# EAGLE design quadcopter (EAGLE 8.1.1)
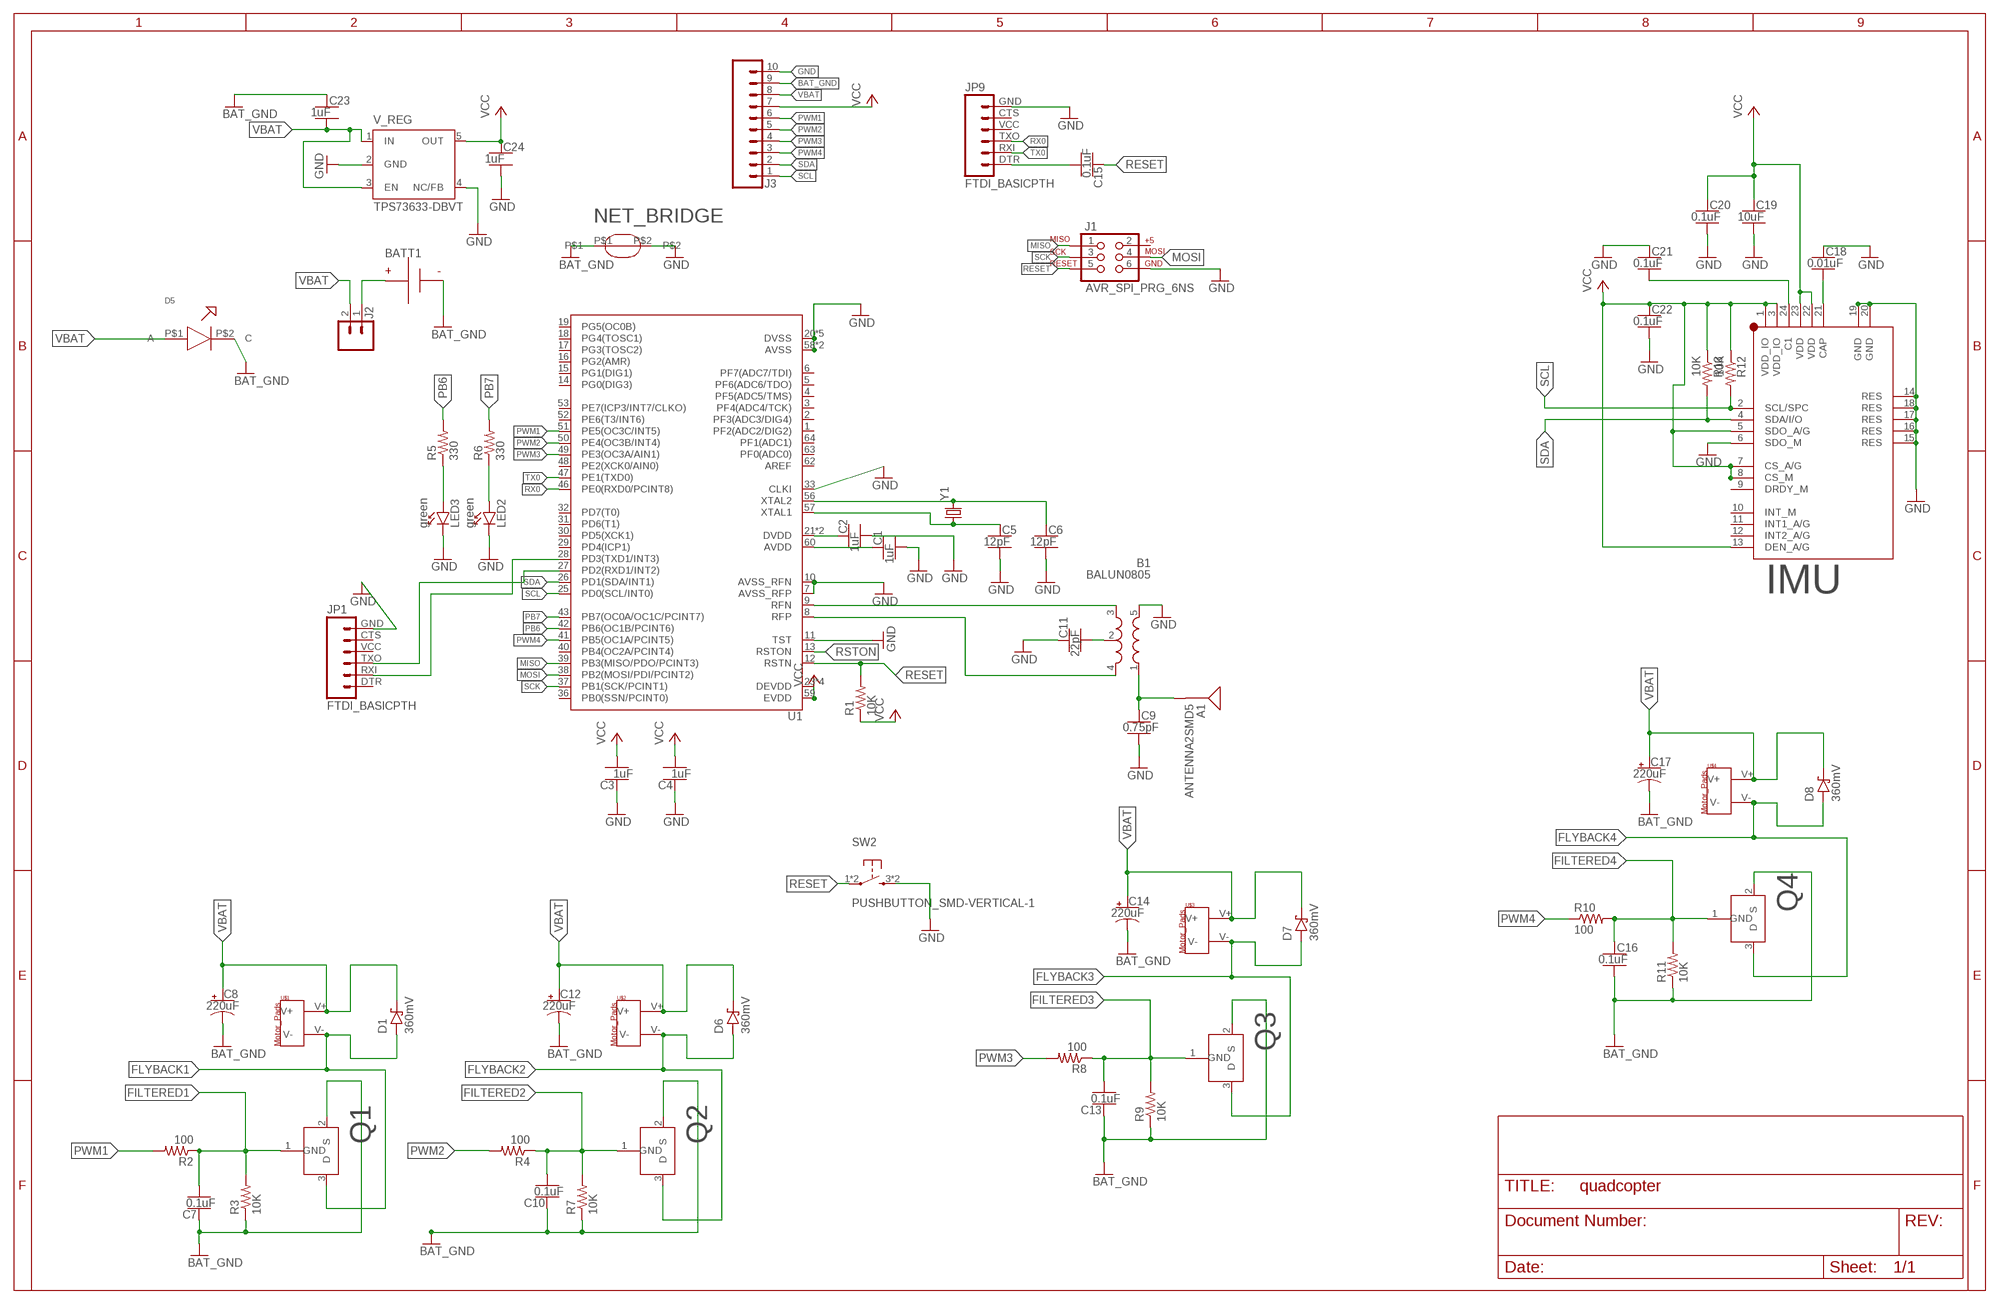
[diagram p0: schematic, sheet 1]

## Parts
A1  ANTENNA2SMD5  [ANTENNA-CHIP5]
B1  BALUN0805  [BALUN]
BATT1  BATTERY-HUBSAN-W/HOLDER  [BATTERY-W/HOLDER-380MAH-HUBSAN]
C1  1uF  CAPACITOR-NP_SMD-2012-0805_CERAMIC-1UF  [CAPC2012X140_HS]
C2  1uF  CAPACITOR-NP_SMD-2012-0805_CERAMIC-1UF  [CAPC2012X140_HS]
C3  1uF  CAPACITOR-NP_SMD-2012-0805_CERAMIC-1UF  [CAPC2012X140_HS]
C4  1uF  CAPACITOR-NP_SMD-2012-0805_CERAMIC-1UF  [CAPC2012X140_HS]
C5  12pF  CAPACITOR-NP_SMD-2012-0805_CERAMIC-12PF  [CAPC2012X140_HS]
C6  12pF  CAPACITOR-NP_SMD-2012-0805_CERAMIC-12PF  [CAPC2012X140_HS]
C7  0.1uF  CAPACITOR-NP_SMD-2012-0805_CERAMIC-0.1UF  [CAPC2012X140_HS]
C8  220uF  CAPACITOR-POL_SMD-7043-D_TANTALUM-220UF  [CAPMP7343X310_HS]
C9  0.75pF  CAPACITOR-NP_SMD-2012-0805_CERAMIC-0.75PF  [CAPC2012X140_HS]
C10  0.1uF  CAPACITOR-NP_SMD-2012-0805_CERAMIC-0.1UF  [CAPC2012X140_HS]
C11  22pF  CAPACITOR-NP_SMD-2012-0805_CERAMIC-22PF  [CAPC2012X140_HS]
C12  220uF  CAPACITOR-POL_SMD-7043-D_TANTALUM-220UF  [CAPMP7343X310_HS]
C13  0.1uF  CAPACITOR-NP_SMD-2012-0805_CERAMIC-0.1UF  [CAPC2012X140_HS]
C14  220uF  CAPACITOR-POL_SMD-7043-D_TANTALUM-220UF  [CAPMP7343X310_HS]
C15  0.1uF  CAPACITOR-NP_SMD-2012-0805_CERAMIC-0.1UF  [CAPC2012X140_HS]
C16  0.1uF  CAPACITOR-NP_SMD-2012-0805_CERAMIC-0.1UF  [CAPC2012X140_HS]
C17  220uF  CAPACITOR-POL_SMD-7043-D_TANTALUM-220UF  [CAPMP7343X310_HS]
C18  0.01uF  CAPACITOR-NP_SMD-2012-0805_CERAMIC-0.01UF  [CAPC2012X140_HS]
C19  10uF  CAPACITOR-NP_SMD-2012-0805_CERAMIC-10UF  [CAPC2012X140_HS]
C20  0.1uF  CAPACITOR-NP_SMD-2012-0805_CERAMIC-0.1UF  [CAPC2012X140_HS]
C21  0.1uF  CAPACITOR-NP_SMD-2012-0805_CERAMIC-0.1UF  [CAPC2012X140_HS]
C22  0.1uF  CAPACITOR-NP_SMD-2012-0805_CERAMIC-0.1UF  [CAPC2012X140_HS]
C23  1uF  CAPACITOR-NP_SMD-2012-0805_CERAMIC-1UF  [CAPC2012X140_HS]
C24  1uF  CAPACITOR-NP_SMD-2012-0805_CERAMIC-1UF  [CAPC2012X140_HS]
D1  360mV  DIODE-SCHOTTKY_SMD-SOD123-360MV  [SOD3716X135_HS]
D5  BLUE_LED  [BLUE_LED]
D6  360mV  DIODE-SCHOTTKY_SMD-SOD123-360MV  [SOD3716X135_HS]
D7  360mV  DIODE-SCHOTTKY_SMD-SOD123-360MV  [SOD3716X135_HS]
D8  360mV  DIODE-SCHOTTKY_SMD-SOD123-360MV  [SOD3716X135_HS]
IMU  9-AXIS_IMU  [9-AXIS_IMU]
J1  AVR_SPI_PRG_6NS  [2X3-NS]
J2  MALE_HEADER_2POS-2X1-0.1IN  [MALE_HEADER_2X1_0.1IN]
J3  SIP-10_TH-254X10  [HDRV10W63P254_10X1_2540X254H838_HS]
JP1  FTDI_BASICPTH  [FTDI_BASIC]
JP9  FTDI_BASICPTH  [FTDI_BASIC]
LED2  green  DIODE-LED_SMD-2012-0805-GREEN  [LEDSC125X200X120-2_HS]
LED3  green  DIODE-LED_SMD-2012-0805-GREEN  [LEDSC125X200X120-2_HS]
NET_BRIDGE  NET_BRIDGE  [NET_BRIDGE]
Q1  N-CHANNEL_MOSFET  [N-CHANNEL_MOSFET]
Q2  N-CHANNEL_MOSFET  [N-CHANNEL_MOSFET]
Q3  N-CHANNEL_MOSFET  [N-CHANNEL_MOSFET]
Q4  N-CHANNEL_MOSFET  [N-CHANNEL_MOSFET]
R1  10K  RESISTOR_SMD-2012-0805-10K  [RESC2012X60_HS]
R2  100  RESISTOR_SMD-2012-0805-100  [RESC2012X60_HS]
R3  10K  RESISTOR_SMD-2012-0805-10K  [RESC2012X60_HS]
R4  100  RESISTOR_SMD-2012-0805-100  [RESC2012X60_HS]
R5  330  RESISTOR_SMD-2012-0805-330  [RESC2012X60_HS]
R6  330  RESISTOR_SMD-2012-0805-330  [RESC2012X60_HS]
R7  10K  RESISTOR_SMD-2012-0805-10K  [RESC2012X60_HS]
R8  100  RESISTOR_SMD-2012-0805-100  [RESC2012X60_HS]
R9  10K  RESISTOR_SMD-2012-0805-10K  [RESC2012X60_HS]
R10  100  RESISTOR_SMD-2012-0805-100  [RESC2012X60_HS]
R11  10K  RESISTOR_SMD-2012-0805-10K  [RESC2012X60_HS]
R12  10K  RESISTOR_SMD-2012-0805-10K  [RESC2012X60_HS]
R13  10K  RESISTOR_SMD-2012-0805-10K  [RESC2012X60_HS]
SW2  PUSHBUTTON_SMD-VERTICAL-1  [TE_FSM8JSMA_HS]
U1  ATMEGA128RFA1  [QFN-64]
U$1  MOTOR_PADS  [MOTOR_PADS]
U$2  MOTOR_PADS  [MOTOR_PADS]
U$3  MOTOR_PADS  [MOTOR_PADS]
U$4  MOTOR_PADS  [MOTOR_PADS]
V_REG  TPS73633-DBVT  [SOT23-DBV]
Y1  CRYSTAL5X3  [CRYSTAL-SMD-5X3]

## Nets
BAT_GND [HIGHCURRENT]: BATT1.-(N) C7.1 C8.2(-) C10.1 C12.2(-) C13.1 C14.2(-) C16.2 C17.2(-) C23.1 D5.P$2(C) J3.9 NET_BRIDGE.P$1 Q1.2(S) Q2.2(S) Q3.2(S) Q4.2(S) R3.1 R7.1 R9.1 R11.1
FILTERED1 [HIGHCURRENT]: C7.2 Q1.1(GND) R2.1 R3.2
FILTERED2 [HIGHCURRENT]: C10.2 Q2.1(GND) R4.1 R7.2
FILTERED3 [HIGHCURRENT]: C13.2 Q3.1(GND) R8.1 R9.2
FILTERED4 [HIGHCURRENT]: C16.1 Q4.1(GND) R10.2 R11.2
FLYBACK1 [HIGHCURRENT]: D1.A Q1.3(D) U$1.V-
FLYBACK2 [HIGHCURRENT]: D6.A Q2.3(D) U$2.V-
FLYBACK3 [HIGHCURRENT]: D7.A Q3.3(D) U$3.V-
FLYBACK4 [HIGHCURRENT]: D8.A Q4.3(D) U$4.V-
GND: B1.5(GND) C1.2 C2.2 C3.1 C4.1 C5.2 C6.2 C9.2 C11.1 C18.1 C19.2 C20.2 C21.1 C22.2 C24.2 IMU.6(SDO_M) IMU.14(RES) IMU.15(RES) IMU.16(RES) IMU.17(RES) IMU.18(RES) IMU.19(GND) IMU.20(GND) J1.6 J3.10 JP1.GND JP9.GND LED2.C LED3.C NET_BRIDGE.P$2 SW2.3 SW2.4 U1.7(AVSS_RFP) U1.10(AVSS_RFN) U1.11(TST) U1.20(DVSS) U1.24(DVSS) U1.33(CLKI) U1.35(DVSS) U1.45(DVSS) U1.55(DVSS) U1.58(AVSS) U1.61(AVSS) V_REG.2(GND) V_REG.4(NC/FB)
MISO: J1.1 U1.39(PB3(MISO/PDO/PCINT3))
MOSI: J1.4 U1.38(PB2(MOSI/PDI/PCINT2))
N$1: C5.1 U1.57(XTAL1) Y1.1
N$2: C2.1 U1.21(DVDD) U1.22(DVDD)
N$3: B1.3(OUT2) U1.9(RFN)
N$4: C1.1 U1.60(AVDD)
N$5: B1.4(OUT1) U1.8(RFP)
N$6: C6.1 U1.56(XTAL2) Y1.3
N$7: B1.2(GND) C11.2
N$8 [RFSIG]: A1.FEED(SIGNAL) B1.1(IN) C9.1
N$9: JP1.TXO U1.27(PD2(RXD1/INT2))
N$10: LED3.A R5.1
N$11: LED2.A R6.1
N$12: JP1.RXI U1.28(PD3(TXD1/INT3))
N$13: C18.2 IMU.21(CAP)
N$14: C15.2 JP9.DTR
N$15: C21.2 IMU.24(C1)
N$18 [HIGHCURRENT]: BATT1.+(P) J2.1
PB6: R5.2 U1.42(PB6(OC1B/PCINT6))
PB7: R6.2 U1.43(PB7(OC0A/OC1C/PCINT7))
PWM1: J3.6 R2.2 U1.51(PE5(OC3C/INT5))
PWM2: J3.5 R4.2 U1.50(PE4(OC3B/INT4))
PWM3: J3.4 R8.2 U1.49(PE3(OC3A/AIN1))
PWM4: J3.3 R10.1 U1.41(PB5(OC1A/PCINT5))
RESET: C15.1 J1.5 R1.2 SW2.1 SW2.2 U1.12(RSTN)
RSTON: U1.13(RSTON)
RX0: JP9.TXO U1.46(PE0(RXD0/PCINT8))
SCK: J1.3 U1.37(PB1(SCK/PCINT1))
SCL: IMU.2(SCL/SPC) J3.1 R12.2 U1.25(PD0(SCL/INT0))
SDA: IMU.4(SDA/I/O) J3.2 R13.2 U1.26(PD1(SDA/INT1))
TX0: JP9.RXI U1.47(PE1(TXD0))
VBAT [HIGHCURRENT]: C8.1(+) C12.1(+) C14.1(+) C17.1(+) C23.2 D1.C D5.P$1(A) D6.C D7.C D8.C J2.2 J3.8 U$1.V+ U$2.V+ U$3.V+ U$4.V+ V_REG.1(IN) V_REG.3(EN)
VCC: C3.2 C4.2 C19.1 C20.1 C22.1 C24.1 IMU.1(VDD_IO) IMU.3(VDD_IO) IMU.5(SDO_A/G) IMU.7(CS_A/G) IMU.8(CS_M) IMU.13(DEN_A/G) IMU.22(VDD) IMU.23(VDD) J3.7 R1.1 R12.1 R13.1 U1.23(DEVDD) U1.34(DEVDD) U1.44(DEVDD) U1.54(DEVDD) U1.59(EVDD) V_REG.5(OUT)
Unconnected: IMU.9(DRDY_M) IMU.10(INT_M) IMU.11(INT1_A/G) IMU.12(INT2_A/G) J1.2 JP1.CTS JP1.DTR JP1.VCC JP9.CTS JP9.VCC U1.1(PF2(ADC2/DIG2)) U1.2(PF3(ADC3/DIG4)) U1.3(PF4(ADC4/TCK)) U1.4(PF5(ADC5/TMS)) U1.5(PF6(ADC6/TDO)) U1.6(PF7(ADC7/TDI)) U1.14(PG0(DIG3)) U1.15(PG1(DIG1)) U1.16(PG2(AMR)) U1.17(PG3(TOSC2)) U1.18(PG4(TOSC1)) U1.19(PG5(OC0B)) U1.29(PD4(ICP1)) U1.30(PD5(XCK1)) U1.31(PD6(T1)) U1.32(PD7(T0)) U1.36(PB0(SSN/PCINT0)) U1.40(PB4(OC2A/PCINT4)) U1.48(PE2(XCK0/AIN0)) U1.52(PE6(T3/INT6)) U1.53(PE7(ICP3/INT7/CLKO)) U1.62(AREF) U1.63(PF0(ADC0)) U1.64(PF1(ADC1))

## Library data of the parts
A1 = quadparts_prebuilt:ANTENNA2: Chip antenna Single endded antenna. Common with smaller chip antennas. CHIP4 package is the GPS Chip Antenna SKU: GPS-08418. CHIP5 package is 2.4GHz chip antenna SKU: WRL-00144.; DATASHEET: http://www.linxtechnologies.com/resources/data-guides/ant-xxx-chp-x.pdf; DIST: Digikey; DISTPN: ANT-2.45-CHPCT-ND; MFR: Linx Technologies Inc.; MPN: ANT-2.45-CHP-T; PRICE: 3.16
B1 = quadparts_prebuilt:BALUN: 0805 footprint balun- Ember 351/357; DATASHEET: http://katalog.we-online.de/pbs/datasheet/748421245.pdf; DIST: Digikey; DISTPN: 732-2230-6-ND; MFR: Wurth Electronics Inc; MPN: 748421245; PRICE: 2.63
BATT1 = quadparts_prebuilt:BATTERY; CREATOR: Swanson; DIST: AMAZON; DISTPN: http://www.amazon.com/dp/B00RROB6Q4?smid=AMNTPWSAB5H0S; MFR: HUBSAN; MPN: X4-H107C-8-in-1
C1-C4 C23 C24 = quadparts_prebuilt:CAPACITOR-NP_: Nonpolarized capacitor; DIST: Digikey; DISTPN: 490-4736-1-ND; MFR: Murata Electronics North America; MPN: GRM21BR71H105KA12L
C5 C6 = quadparts_prebuilt:CAPACITOR-NP_: Nonpolarized capacitor; DIST: Digikey; DISTPN: 490-5531-1-ND; MFR: Murata Electronics North America; MPN: GRM21A5C2E120JW01D
C7 C10 C13 C15 C16 C20-C22 = quadparts_prebuilt:CAPACITOR-NP_: Nonpolarized capacitor; DIST: Digikey; DISTPN: 490-1666-1-ND; MFR: Murata Electronics North America; MPN: GRM21BR71H104KA01L
C8 C12 C14 C17 = quadparts_prebuilt:CAPACITOR-POL_: Polarized capacitor; DIST: Digikey; DISTPN: 478-8912-1-ND; MFR: AVX Corporation; MPN: TAJD227K006RNJ
C9 = quadparts_prebuilt:CAPACITOR-NP_: Nonpolarized capacitor; DIST: Digikey; DISTPN: 490-3585-1-ND; MFR: Murata Electronics North America; MPN: GQM2195C2AR75CB01D
C11 = quadparts_prebuilt:CAPACITOR-NP_: Nonpolarized capacitor; DIST: Digikey; DISTPN: 490-5534-1-ND; MFR: Murata Electronics North America; MPN: GRM21A5C2E220JW01D
C18 = quadparts_prebuilt:CAPACITOR-NP_: Nonpolarized capacitor; DIST: Digikey; DISTPN: 490-8295-1-ND; MFR: Murata Electronics North America; MPN: GRM2195C1H103FA01D
C19 = quadparts_prebuilt:CAPACITOR-NP_: Nonpolarized capacitor; DIST: Digikey; DISTPN: 490-5523-1-ND; MFR: Murata Electronics North America; MPN: GRM21BR61E106KA73L
D1 D6-D8 = quadparts_prebuilt:DIODE-SCHOTTKY_: Schottky diode; DIST: Digikey; DISTPN: CRS08QMCT-ND; MFR: Toshiba Semiconductor and Storage; MPN: CRS08(TE85L,Q,M)
D5 = LED:BLUE_LED; CREATOR: John Wu; DATASHEET: https://media.digikey.com/pdf/Data%20Sheets/Everlight%20PDFs/QTLP600C.pdf; DIST: Digikey; DISTPN: 1080-1401-1-ND; MFR: Everlight Electronics Co Ltd; MPN: QTLP600CBTR; REVIEWER: Josh Crook
IMU = quadparts-nick:9-AXIS_IMU: LSM9DS1TR 9-Axis IMU; CREATOR: Nicholas Deagon; DIST: Digikey; DISTPN: 497-14946-1-ND; MFR: STMicroelectronics; MPN: LSM9DS1TR; REVIEWER: Joshua Crook
J1 = quadparts_prebuilt:AVR_SPI_PRG_6: AVR ISP 6 Pin This is the reduced ISP connector for AVR programming. Common on Arduino. This footprint will take up less PCB space and can be used with a 10-pin to 6-pin adapter such as SKU: BOB-08508; DATASHEET: http://portal.fciconnect.com/Comergent//fci/drawing/67996.pdf; DIST: Digikey; DISTPN: 609-3234-ND; MFR: Amphenol FCI; MPN: 67997-206HLF; PRICE: 0.31
J2 = quadparts-nick:MALE_HEADER_2POS: 2 pin single inline pin header, socket, or connector; CREATOR: SWANSON; DIST: Digikey; DISTPN: 3M9447-ND; MFR: 3M; MPN: 961102-6404-AR
J3 = quadparts_prebuilt:SIP-10_: 10 pin single inline pin header, socket, or connector; DATASHEET: http://portal.fciconnect.com/Comergent//fci/drawing/68000.pdf; DIST: Digikey; DISTPN: 609-3250-ND; MFR: Amphenol FCI; MPN: 68000-110HLF; PRICE: 0.55
JP1 JP9 = quadparts_prebuilt:FTDI_BASIC: FTDI Basic header with labels; DATASHEET: http://portal.fciconnect.com/Comergent//fci/drawing/68015.pdf; DIST: Digikey; DISTPN: 609-3327-ND; MFR: Amphenol FCI; MPN: 68016-406HLF; PRICE: 0.33
LED2 LED3 = quadparts_prebuilt:DIODE-LED_: Light emitting diode; DIST: Digikey; DISTPN: 160-1179-1-ND; MFR: Lite-On Inc; MPN: LTST-C170GKT
NET_BRIDGE = quadparts-nick:NET_BRIDGE; CREATOR: Nicholas Deagon; REVIEWER: Joshua Crook
Q1-Q4 = quadparts-nick:N-CHANNEL_MOSFET: N-Channel MOSFET; CREATOR: Nicholas Deagon; DIST: Digikey; DISTPN: SI2302CDS-T1-E3CT-ND; MFR: Vishay Siliconix; MPN: SI2302CDS-T1-E3; REVIEWER: Joshua Crook
R1 R3 R7 R9 R11-R13 = quadparts_prebuilt:RESISTOR_: Resistor; DIST: Digikey; DISTPN: 311-10KARCT-ND; MFR: Yageo; MPN: RC0805JR-0710KL
R2 R4 R8 R10 = quadparts_prebuilt:RESISTOR_: Resistor; DIST: Digikey; DISTPN: 311-100ARCT-ND; MFR: Yageo; MPN: RC0805JR-07100RL
R5 R6 = quadparts_prebuilt:RESISTOR_: Resistor; DIST: Digikey; DISTPN: 311-330ARCT-ND; MFR: Yageo; MPN: RC0805JR-07330RL
SW2 = quadparts_prebuilt:PUSHBUTTON_: Pushbutton with 2 pins shorting 1 to 2 and two extra mounting pins 3 & 4; DIST: Digikey; DISTPN: 450-1129-ND; MFR: TE Connectivity Alcoswitch Switches; MPN: FSM4JSMA
U1 = quadparts_prebuilt:ATMEGA128RFA1: ATmega128RFA1 8-bit AVR Microcontroller with Low Power 2.4GHz Transceiver for ZigBee and IEEE 802.15.4; CREATOR: Swanson; DATASHEET: http://www.atmel.com/Images/Atmel-8266-MCU_Wireless-ATmega128RFA1_Datasheet.pdf; DIST: Digikey; DISTPN: ATMEGA128RFA1-ZUR00DKR-ND; MFR: Atmel; MPN: ATMEGA128RFA1-ZUR00; PRICE: 10.21
U$1-U$4 = quadparts_prebuilt:MOTOR_PADS; DIST: NA; DISTPN: NA; MFR: NA; MPN: NA
V_REG = quadparts_prebuilt:TPS73633-DBVT; DATASHEET: http://www.ti.com/lit/ds/symlink/lp3985.pdf; DIST: Digikey; DISTPN: LP3985IM5X-3.0/NOPBCT-ND; MFR: Texas Instruments; MPN: LP3985IM5X-3.0/NOPB; PRICE: 0.59
Y1 = quadparts_prebuilt:CRYSTAL: Various standard crystals. Proven footprints.; DATASHEET: http://www.abracon.com/Resonators/abm3b.pdf; DIST: Digikey; DISTPN: 535-9122-1-ND; MFR: Abracon LLC; MPN: ABM3B-16.000MHZ-B2-T; PRICE: 0.68; PROD_ID: XTAL-08218

## Net classes
1 RFSIG: width 0.457 mm
2 HIGHCURRENT: width 0.457 mm

## Board
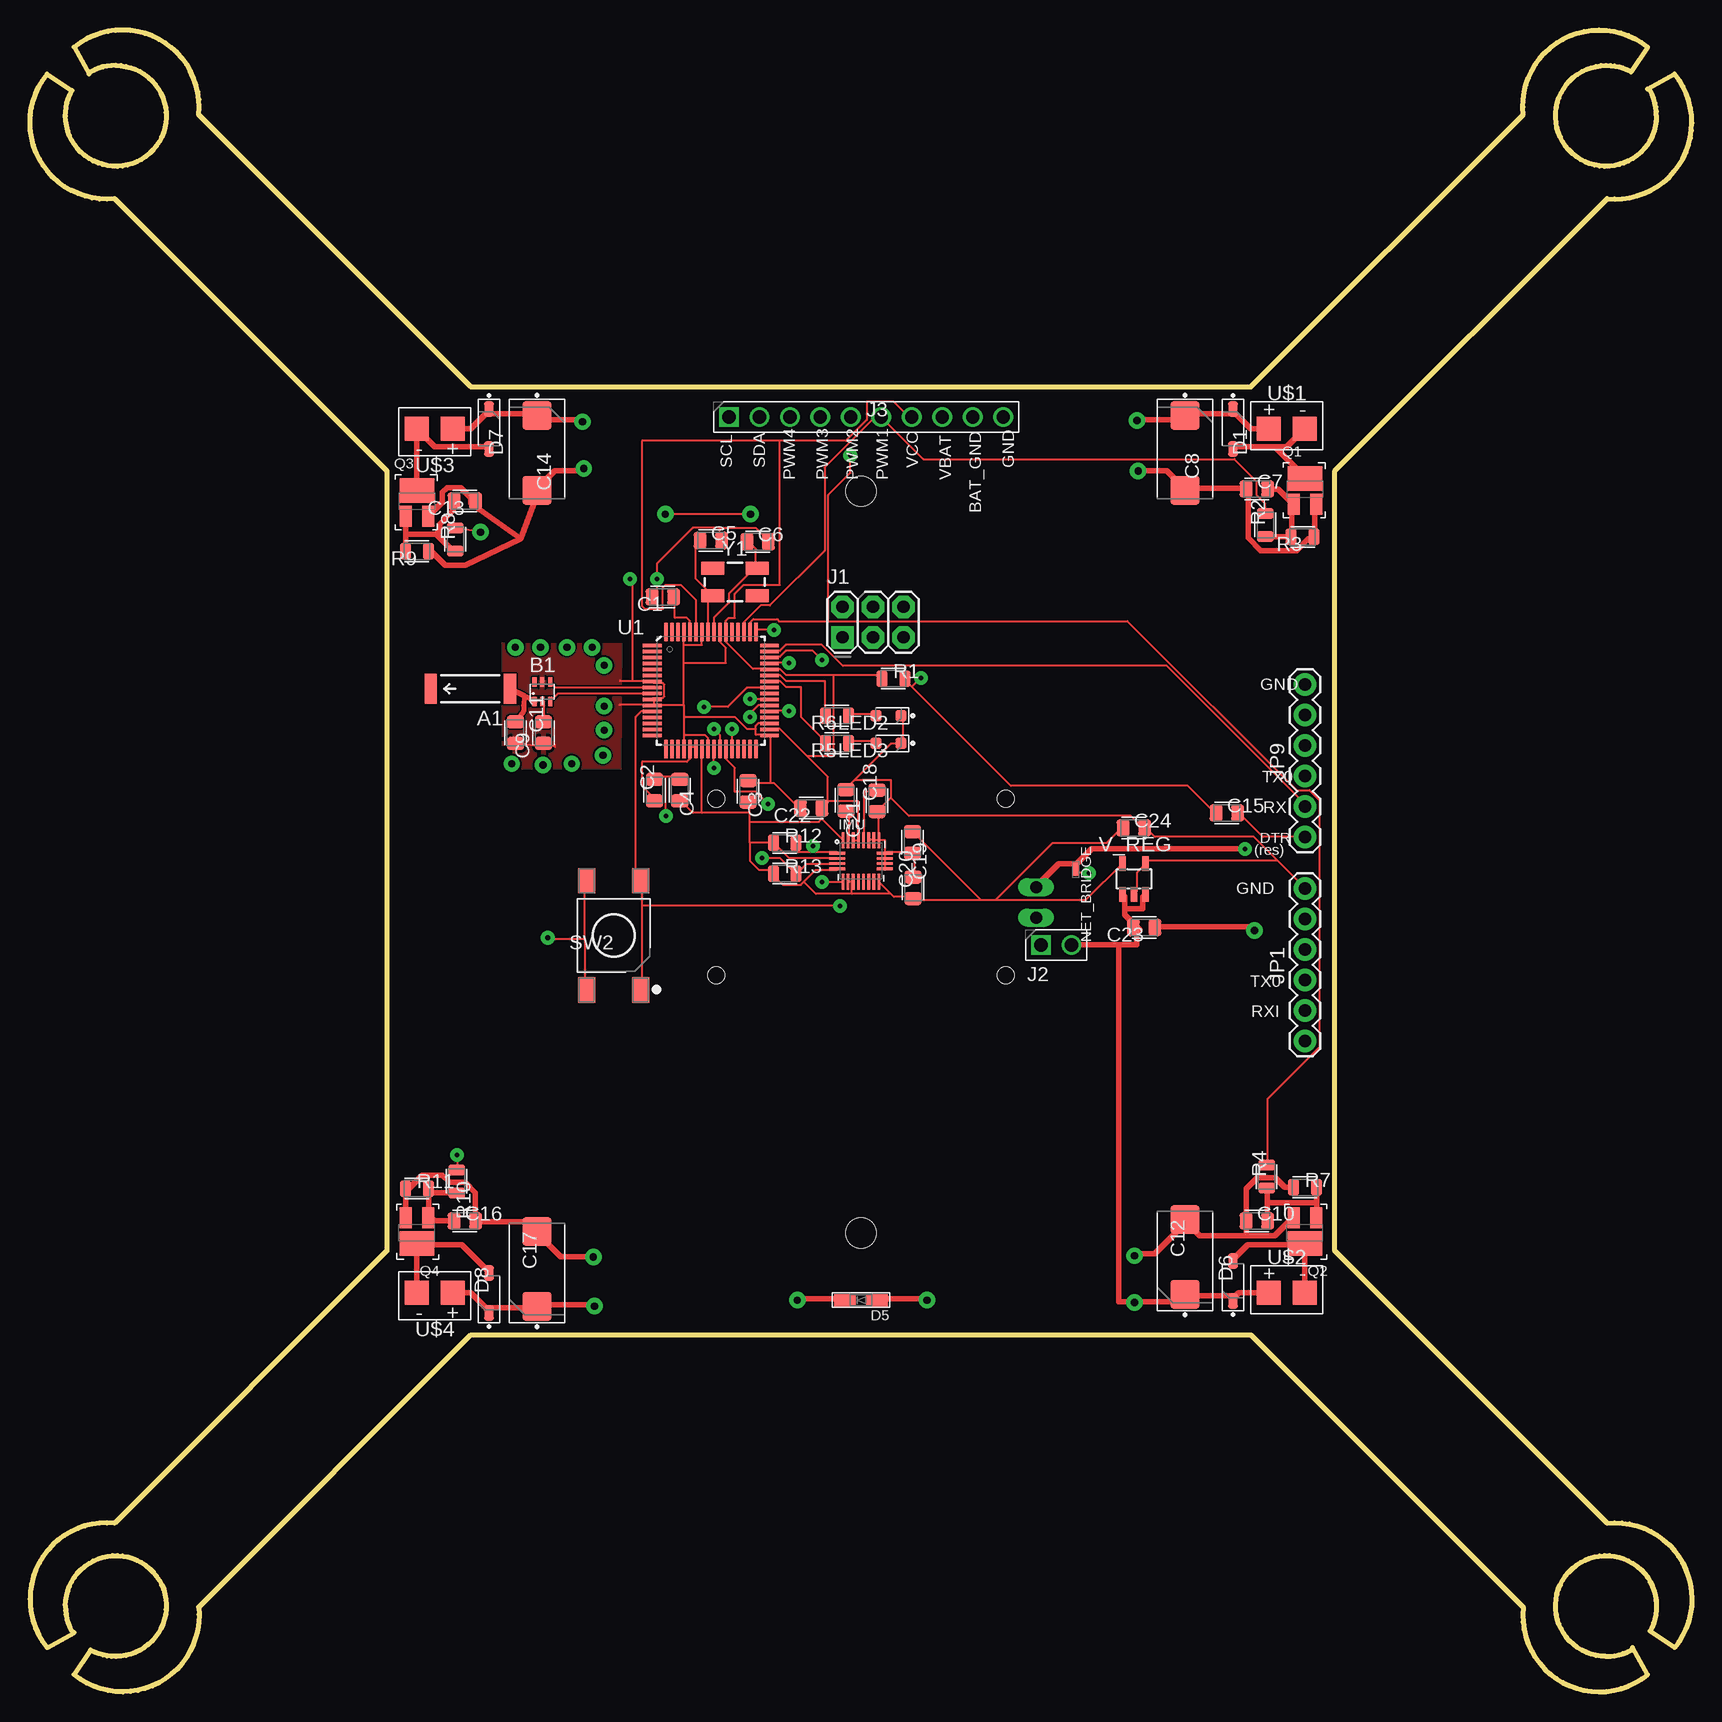
[diagram p1: board, top side]
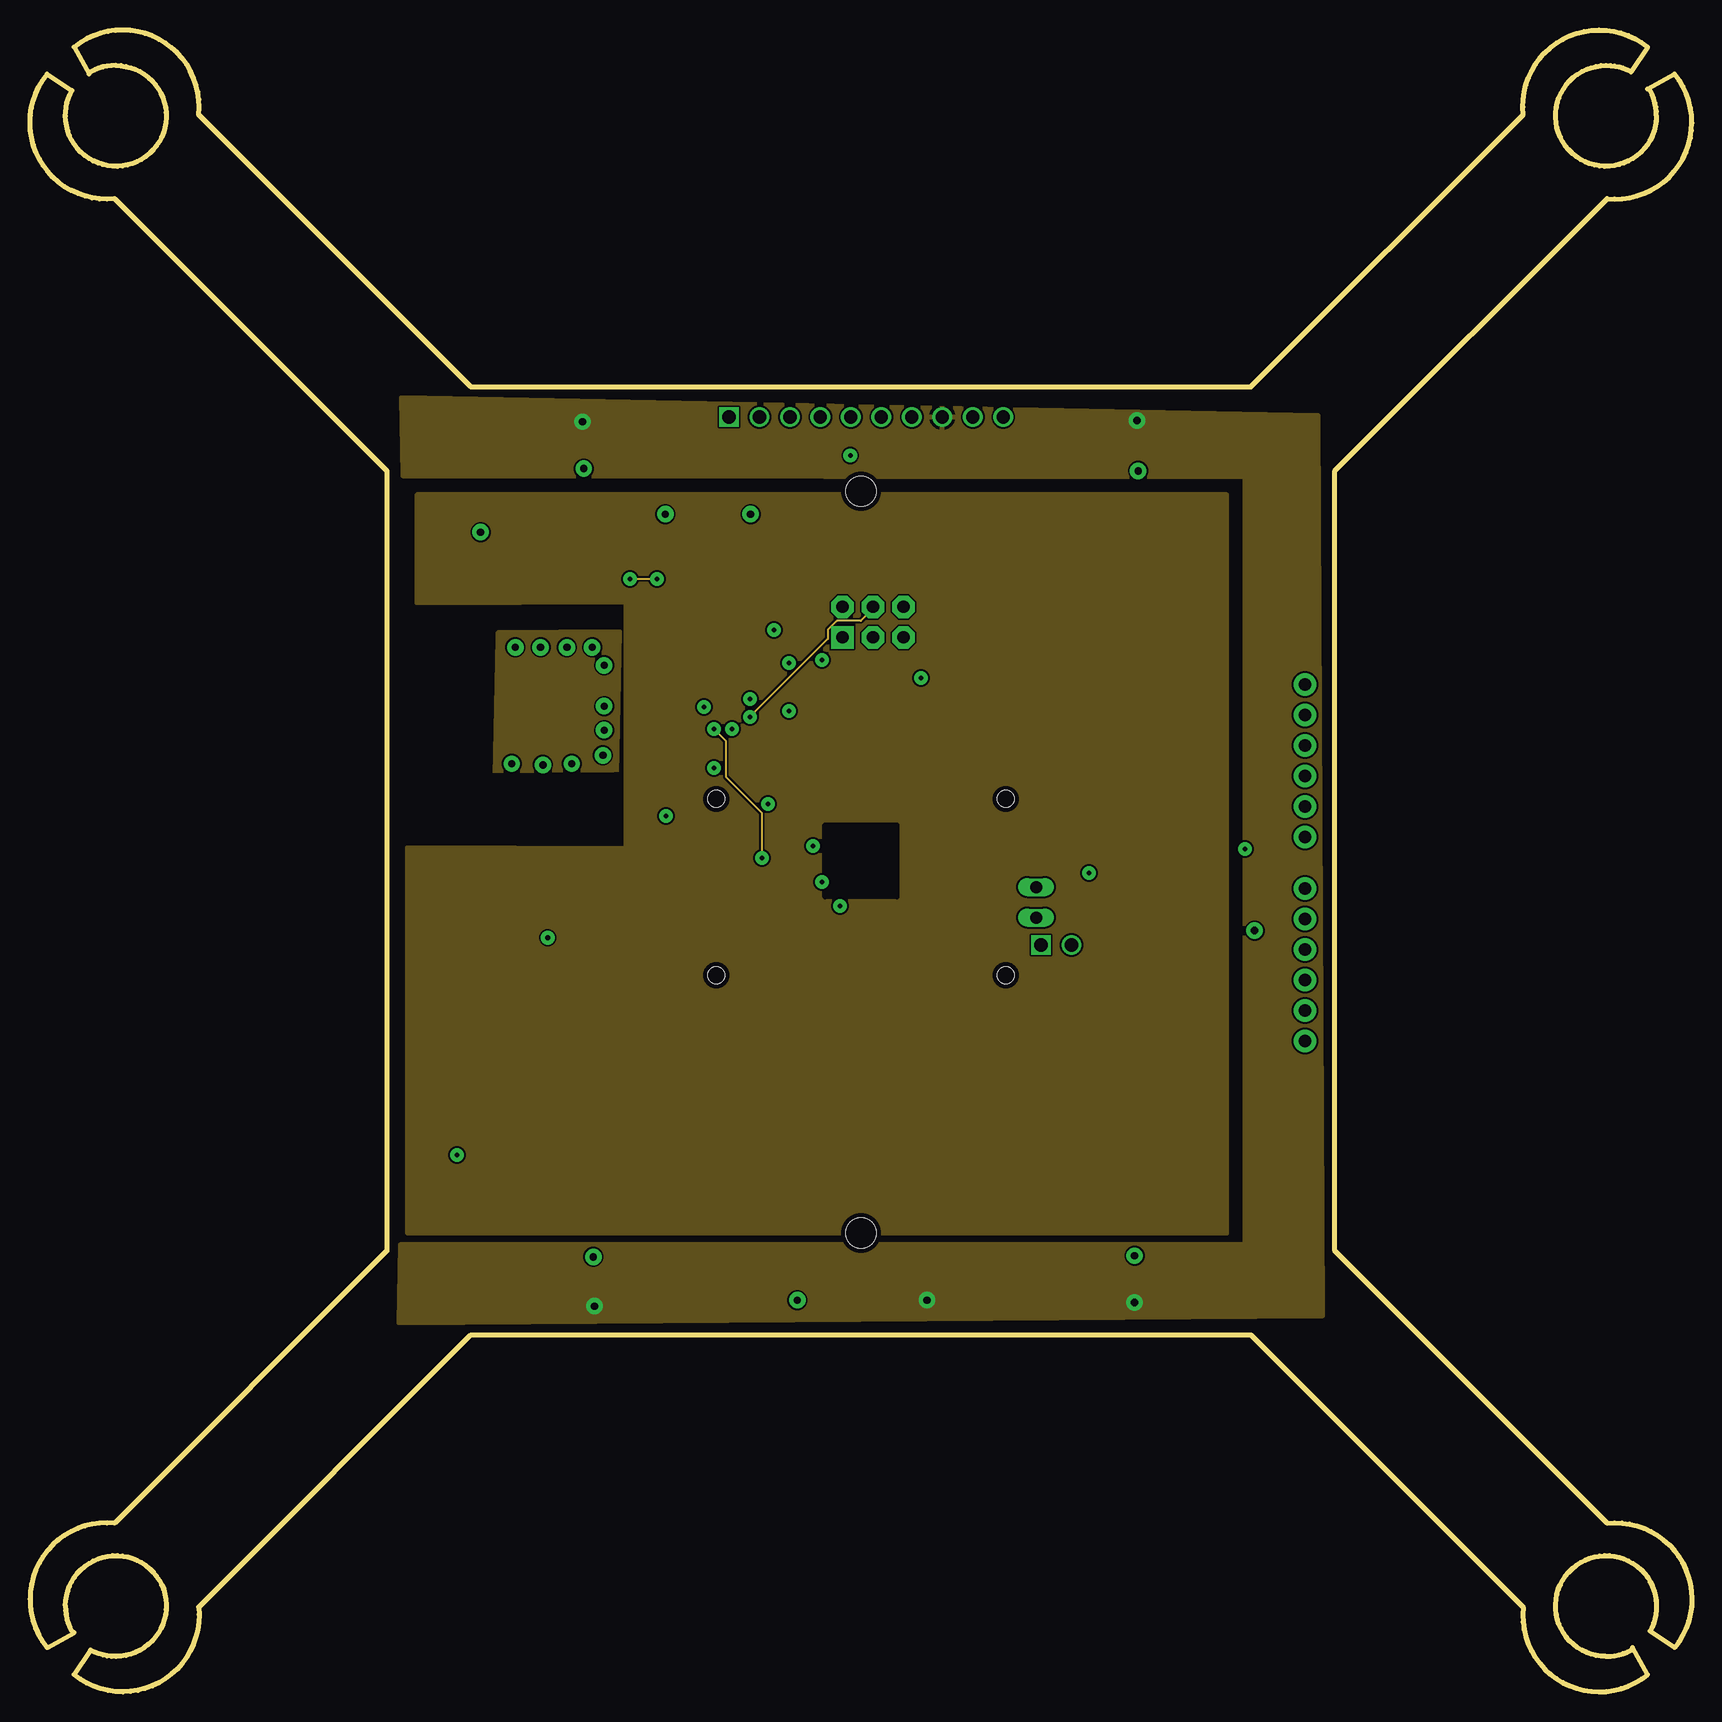
[diagram p2: board, inner layer Route2]
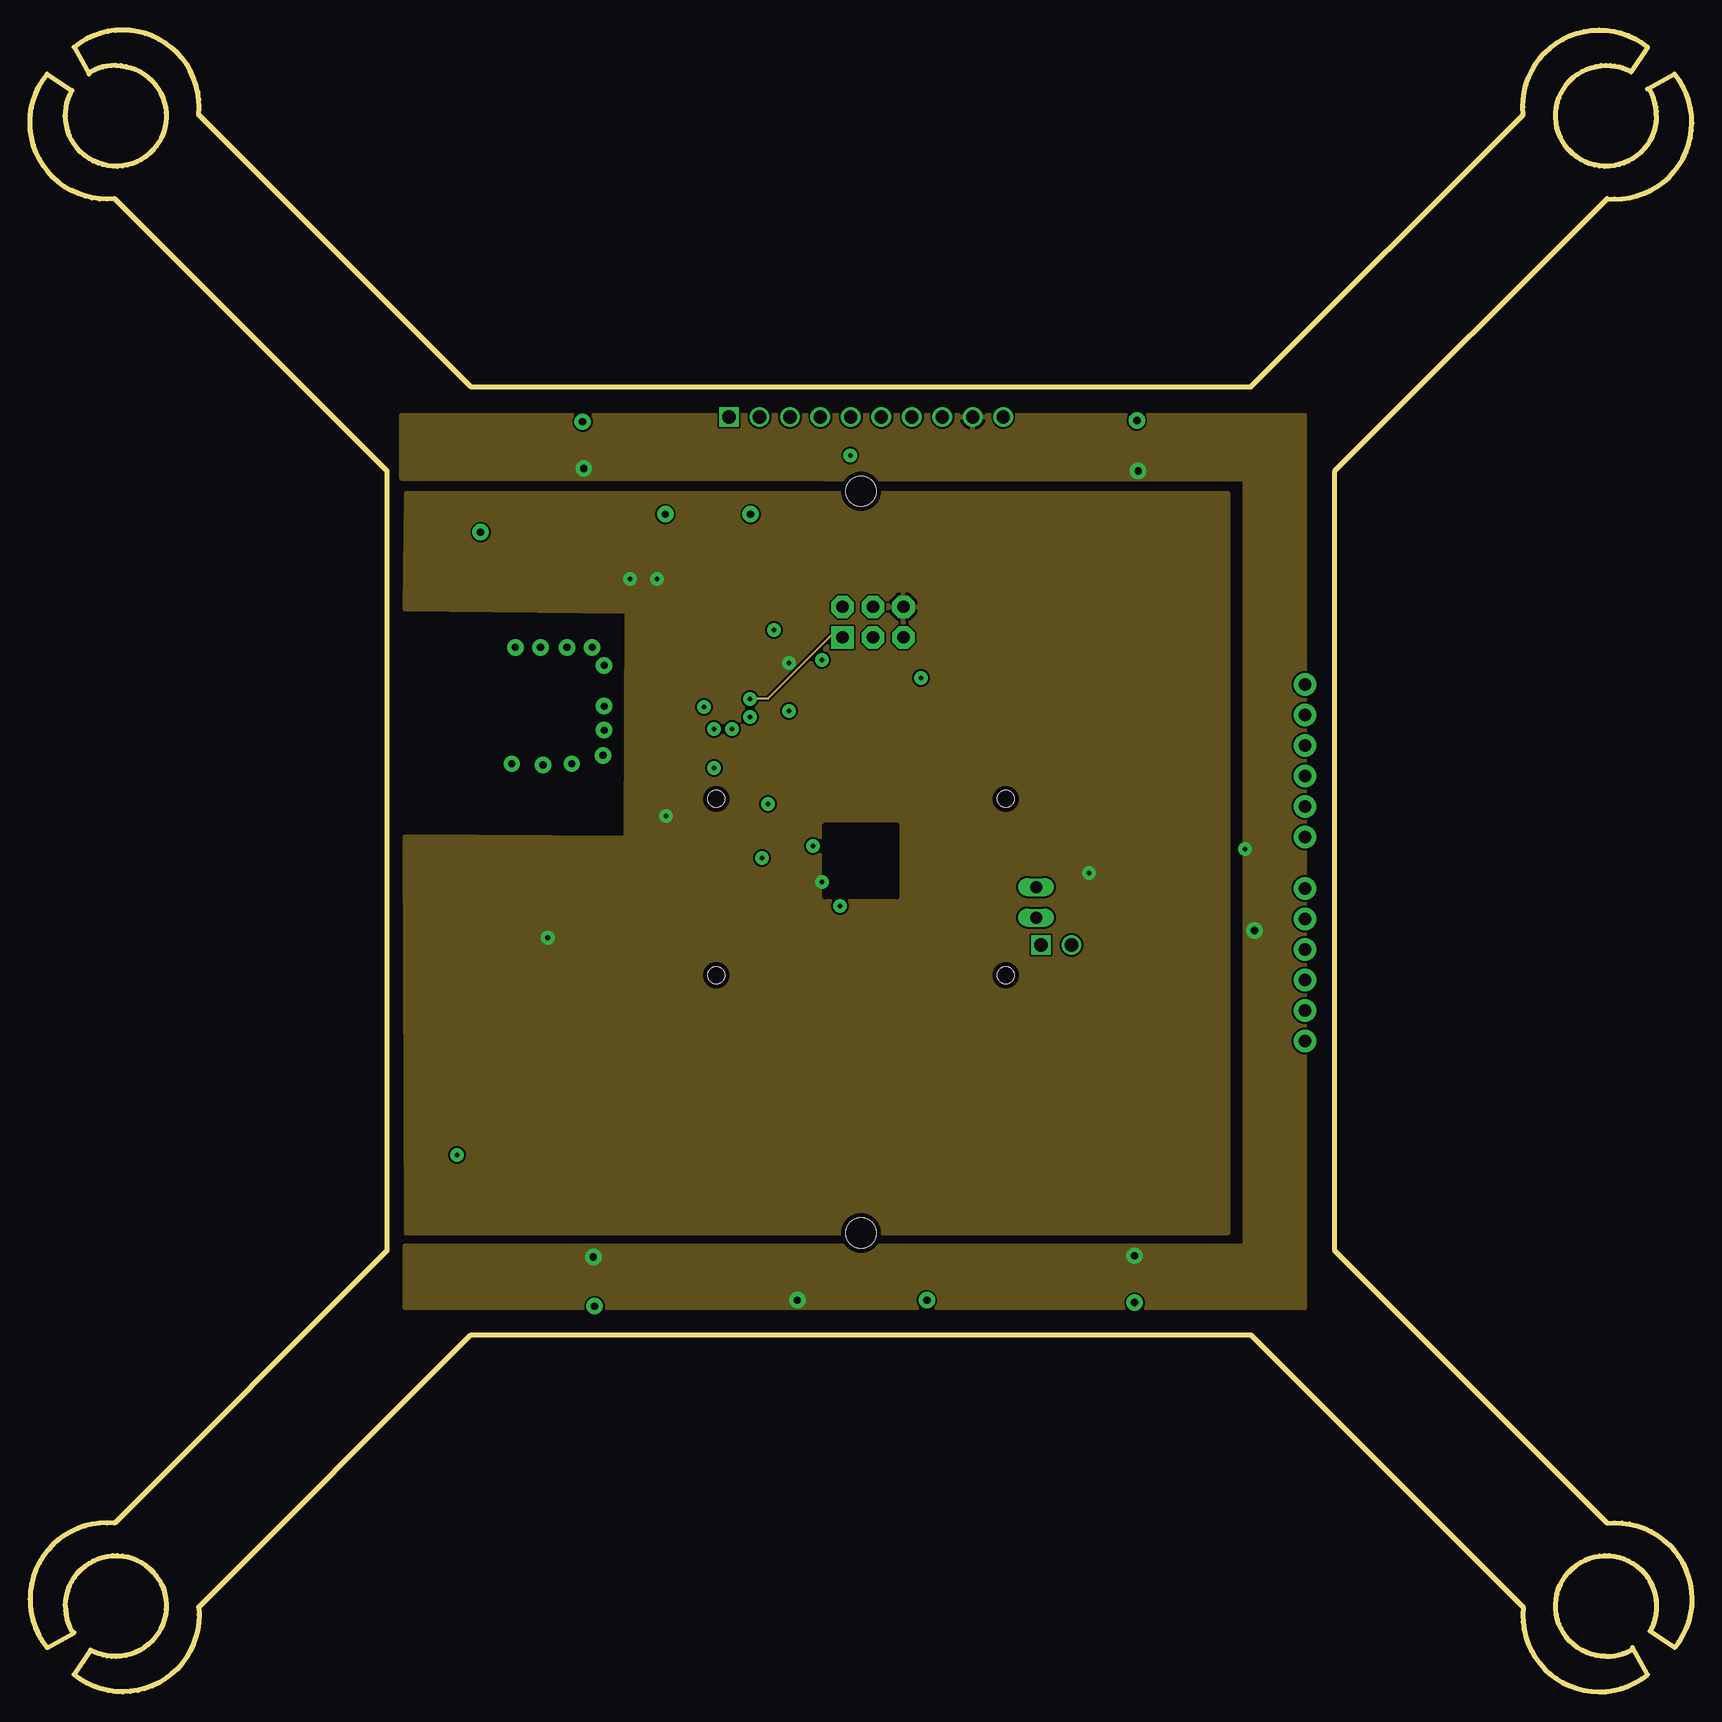
[diagram p3: board, inner layer Route15]
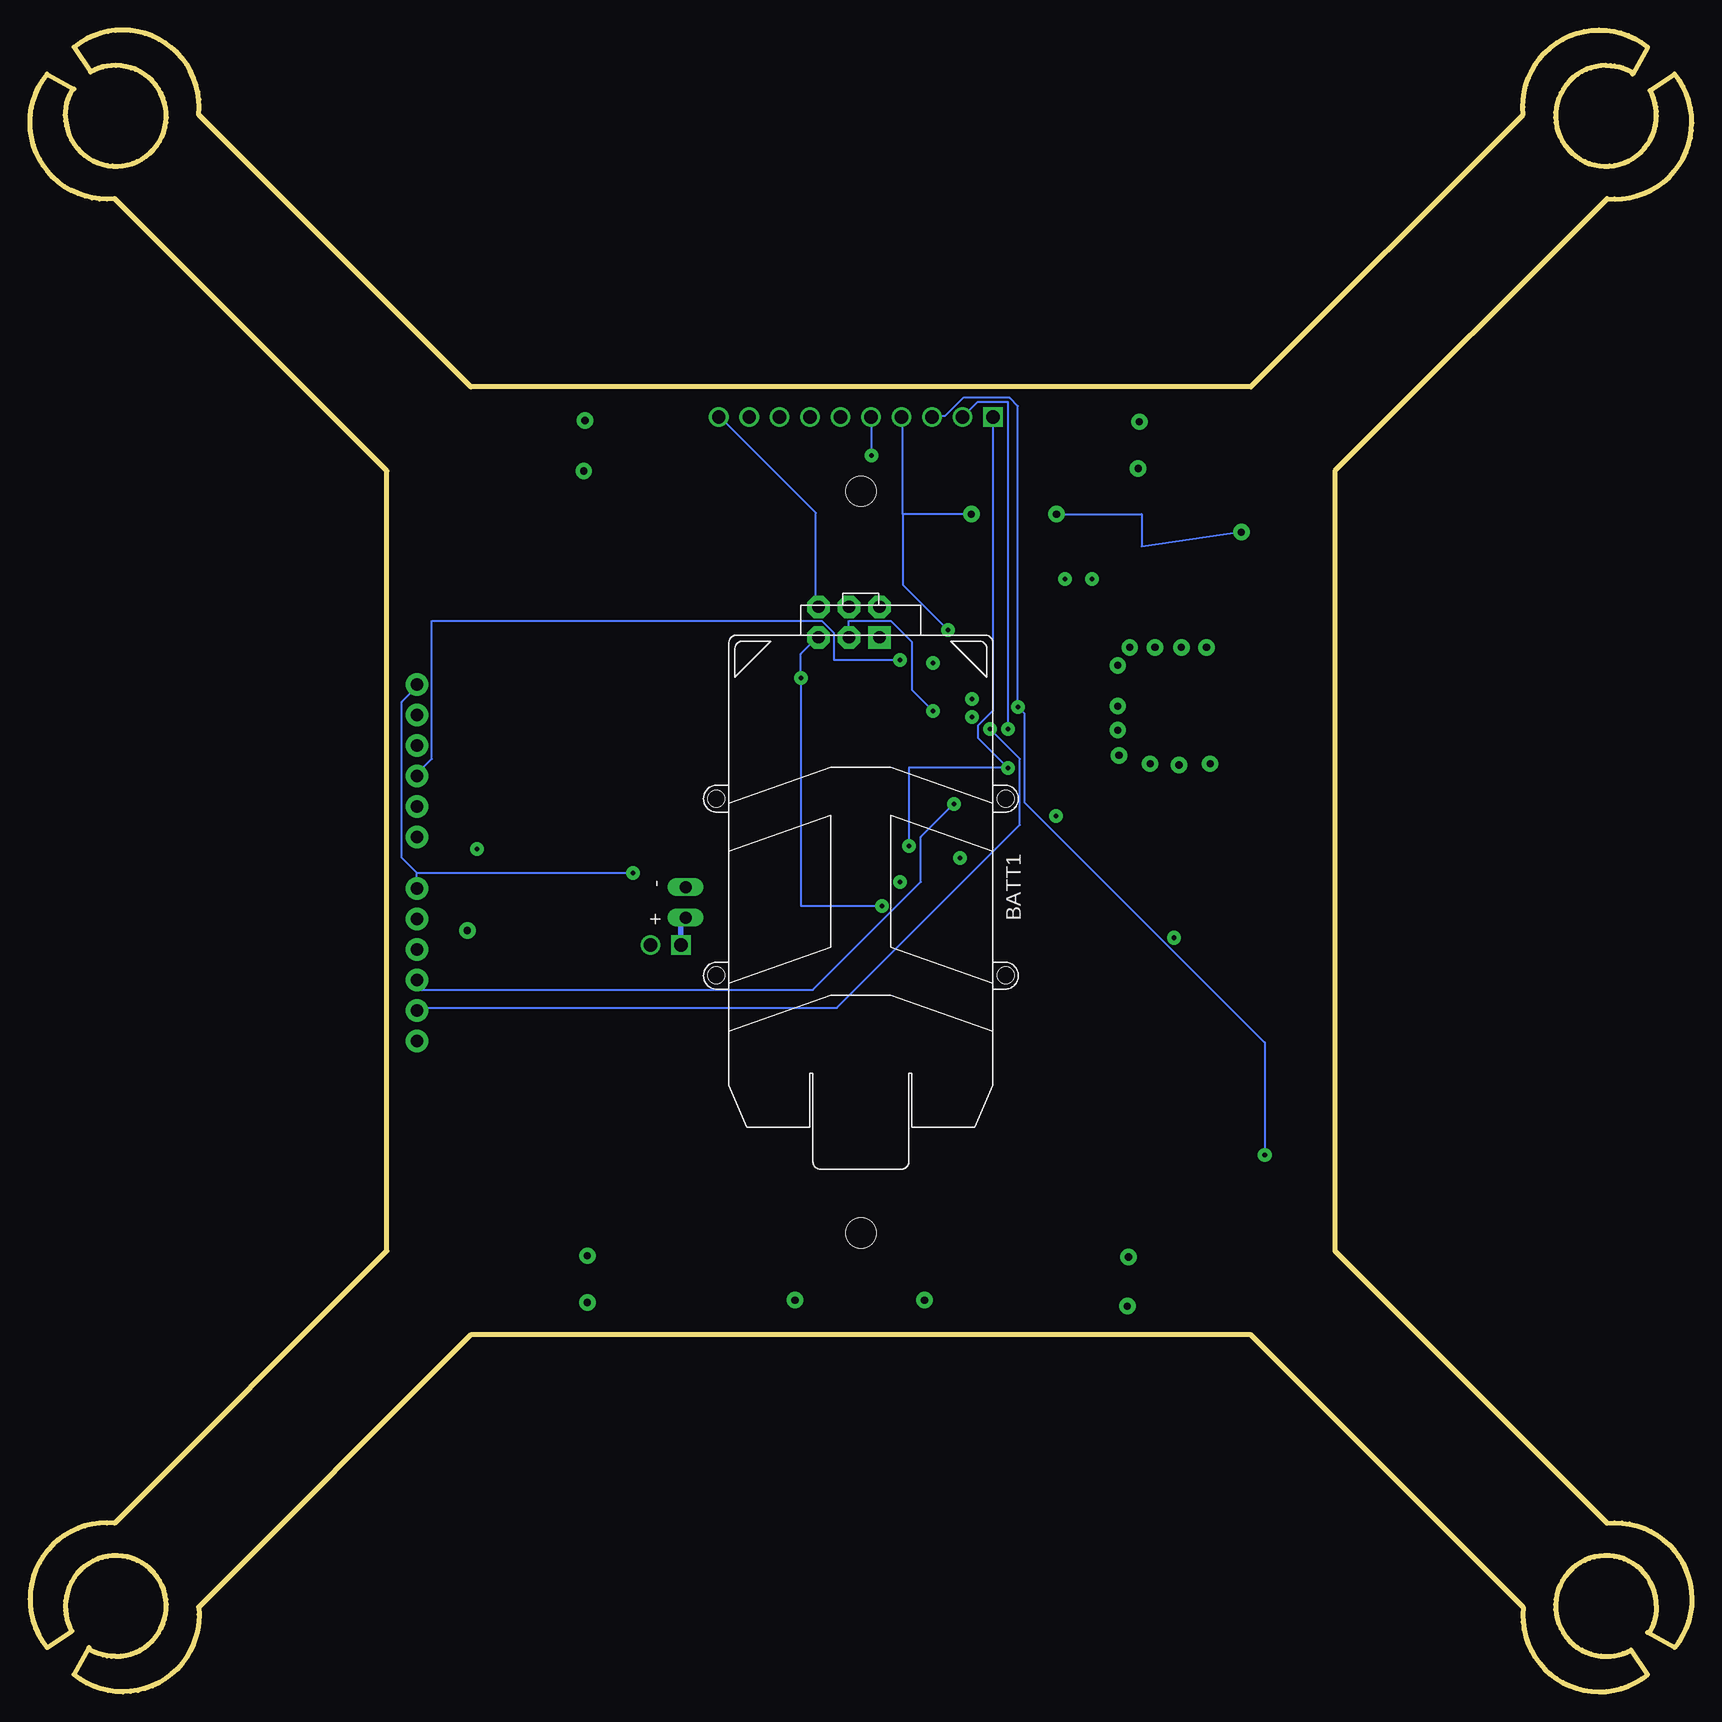
[diagram p4: board, bottom side, seen from below]

Size 138.49 x 138.49 mm. Coordinates in mm from the lower left corner, seen from the top.
Outline: 5.06,135.01 arc-30 7.16,135.53 arc-270 2.96,131.33 arc-30 3.48,133.43 1.43,134.81 arc135 7.06,124.43 29.75,101.75 29.75,36.75 7.06,14.06 arc135 1.43,3.68 3.68,4.93
Outline: 4.93,134.81 3.68,137.06 arc-135 14.06,131.43 36.75,108.75 101.75,108.75 124.43,131.43 arc-135 134.81,137.06 133.43,135.01 arc30 131.33,135.53 arc270 135.53,131.33 arc30 135.01,133.43
Outline: 3.48,5.06 arc-30 2.96,7.16 arc-270 7.16,2.96 arc-30 5.06,3.48 3.68,1.43 arc135 14.06,7.06 36.75,29.75 101.75,29.75 124.43,7.06 arc135 134.81,1.43 133.56,3.68
Outline: 133.43,3.48 arc-30 131.33,2.96 arc-270 135.53,7.16 arc-30 135.01,5.06 137.06,3.68 arc135 131.43,14.06 108.75,36.75 108.75,101.75 131.43,124.43 arc135 137.06,134.81 134.81,133.56
Copper layers (1*2*15*16): Top 0.035559375mm / dielectric 1.501140625mm / Route2 0.035559375mm / dielectric 0.149859375mm / Route15 0.035559375mm / dielectric 0.200659375mm / Bottom 0.035559375mm
Design rules "4pcb-66board": minimum track width 6mil, minimum drill 15mil, track to track 6mil, track to pad 6mil, pad to pad 6mil, via to via 6mil, smd to smd 6mil, copper to edge 15mil, drill to drill 10mil, minimum pad ring 10mil, minimum via ring 15mil, stop-mask expansion 4mil, vias tented up to drill 0mil, thermal gap 10mil
Holes 2.5 mm at 69.25,38.25 69.25,100.05
tRestrict: area 31.2,71.2 to 49.8,76.6; area 31.1,77.2 to 39,91; area 31.1,87.6 to 49.8,91; area 68.1,68.3 to 70.3,70.1
bRestrict: area 31.2,71.2 to 49.7,90.2; area 68.1,68.3 to 70.3,70.1

### Footprints (pad centres in the part's own frame; a part is rotated, then mirrored left to right if it is on the bottom)
ANTENNA-CHIP5 = smd 1.016 x 2.54: FEED -3.302,0; NC 3.302,0
BALUN = smd 0.35 x 0.8: 1 -0.65,-0.8; 2 0,-0.8; 3 0.65,-0.8; 4 0.65,0.8; 5 0,0.8; 6 -0.65,0.8
BATTERY-W/HOLDER-380MAH-HUBSAN = drill 1 long: + -2.54,14.605; - 0,14.605 | hole 1.4: -7.35,-12.05; -7.35,12.05; 7.35,-12.05; 7.35,12.05
CAPC2012X140_HS = smd 1.08 x 1.42: 1 -0.895,0; 2 0.895,0
CAPMP7343X310_HS = smd 2.37 x 2.43: 1 -3.12,0; 2 3.12,0
SOD3716X135_HS = smd 1.25 x 0.8: A 1.665,0; C -1.665,0
BLUE_LED = smd 1.8 x 1: P$1 -1.325,0; P$2 1.325,0
9-AXIS_IMU = smd 0.225 x 1.35: 1 -1.505,1.725; 6 -1.505,-1.725; 7 -1.075,-1.725; 8 -0.645,-1.725; 9 -0.215,-1.725; 10 0.215,-1.725; 11 0.645,-1.725; 12 1.075,-1.725; 13 1.505,-1.725; 18 1.505,1.725; 19 1.075,1.725; 20 0.645,1.725; 21 0.215,1.725; 22 -0.215,1.725; 23 -0.645,1.725; 24 -1.075,1.725 | smd 1.35 x 0.225: 2 -1.975,0.645; 3 -1.975,0.215; 4 -1.975,-0.215; 5 -1.975,-0.645; 14 1.975,-0.645; 15 1.975,-0.215; 16 1.975,0.215; 17 1.975,0.645
2X3-NS = drill 1.016 pad 1.88 square: 1 -2.54,-1.27 | drill 1.016 pad 1.88 octagon: 2 -2.54,1.27; 3 0,-1.27; 4 0,1.27; 5 2.54,-1.27; 6 2.54,1.27
MALE_HEADER_2X1_0.1IN = drill 1.1 pad 1.65 square: 1 0,0 | drill 1.1 pad 1.65: 2 2.54,0
HDRV10W63P254_10X1_2540X254H838_HS = drill 1.1 pad 1.65 square: 1 0,0 | drill 1.1 pad 1.65: 2 2.54,0; 3 5.08,0; 4 7.62,0; 5 10.16,0; 6 12.7,0; 7 15.24,0; 8 17.78,0; 9 20.32,0; 10 22.86,0
FTDI_BASIC = drill 1.016 pad 1.88: CTS 10.16,0; DTR 0,0; GND 12.7,0; RXI 2.54,0; TXO 5.08,0; VCC 7.62,0
LEDSC125X200X120-2_HS = smd 0.94 x 0.99: A 1.045,0; C -1.045,0
NET_BRIDGE = smd 0.6 x 0.5: P$1 -0.2,0; P$2 0.3,0
N-CHANNEL_MOSFET = smd 1 x 1.725: 1 -0.95,-1.27; 2 0.95,-1.27 | smd 2.9 x 2.05: 3 0,0.875
RESC2012X60_HS = smd 0.92 x 1.38: 1 -0.955,0; 2 0.955,0
TE_FSM8JSMA_HS = smd 1.4 x 2.1: 1 -2.25,4.55; 2 -2.25,-4.55; 3 2.25,4.55; 4 2.25,-4.55
QFN-64 = smd 1.562 x 0.28: 1 -4.881,3.75; 2 -4.881,3.25; 3 -4.881,2.75; 4 -4.881,2.25; 5 -4.881,1.75; 6 -4.881,1.25; 7 -4.881,0.75; 8 -4.881,0.25; 9 -4.881,-0.25; 10 -4.881,-0.75; 11 -4.881,-1.25; 12 -4.881,-1.75; 13 -4.881,-2.25; 14 -4.881,-2.75; 15 -4.881,-3.25; 16 -4.881,-3.75; 33 4.881,-3.75; 34 4.881,-3.25; 35 4.881,-2.75; 36 4.881,-2.25; 37 4.881,-1.75; 38 4.881,-1.25; 39 4.881,-0.75; 40 4.881,-0.25; 41 4.881,0.25; 42 4.881,0.75; 43 4.881,1.25; 44 4.881,1.75; 45 4.881,2.25; 46 4.881,2.75; 47 4.881,3.25; 48 4.881,3.75 | smd 0.28 x 1.562: 17 -3.75,-4.881; 18 -3.25,-4.881; 19 -2.75,-4.881; 20 -2.25,-4.881; 21 -1.75,-4.881; 22 -1.25,-4.881; 23 -0.75,-4.881; 24 -0.25,-4.881; 25 0.25,-4.881; 26 0.75,-4.881; 27 1.25,-4.881; 28 1.75,-4.881; 29 2.25,-4.881; 30 2.75,-4.881; 31 3.25,-4.881; 32 3.75,-4.881; 49 3.75,4.881; 50 3.25,4.881; 51 2.75,4.881; 52 2.25,4.881; 53 1.75,4.881; 54 1.25,4.881; 55 0.75,4.881; 56 0.25,4.881; 57 -0.25,4.881; 58 -0.75,4.881; 59 -1.25,4.881; 60 -1.75,4.881; 61 -2.25,4.881; 62 -2.75,4.881; 63 -3.25,4.881; 64 -3.75,4.881
MOTOR_PADS = smd 2 x 2: V+ -1,0; V- 2,0
SOT23-DBV = smd 0.55 x 1.2: 1 -0.95,-1.3; 2 0,-1.3; 3 0.95,-1.3; 4 0.95,1.3; 5 -0.95,1.3
CRYSTAL-SMD-5X3 = smd 1.9 x 1.1: 1 -1.85,-1.15; 2 1.85,-1.15; 3 1.85,1.15; 4 -1.85,1.15

### Placement (x,y rotation side)
A1  36.7,83.6 180 top
B1  42.7,83.35 0 top
BATT1  69.25,67.06 90 bottom
C1  52.75,91.25 180 top
C2  52.05,75.15 90 top
C3  59.85,75.05 270 top
C4  54.15,75.15 270 top
C5  56.75,95.95 0 top
C6  60.65,95.85 0 top
C7  102.25,100.25 0 top
C8  96.25,103.25 270 top
C9  40.45,79.95 270 top
C10  102.25,39.25 0 top
C11  42.8,79.95 90 top
C12  96.25,36.25 90 top
C13  36.25,99.25 180 top
C14  42.25,103.25 270 top
C15  99.75,73.25 0 top
C16  36.25,39.25 0 top
C17  42.25,35.25 90 top
C18  70.6,74.25 90 top
C19  73.55,70.8 270 top
C20  73.6,67 90 top
C21  68,74.3 270 top
C22  65.1,73.65 180 top
C23  92.85,63.7 180 top
C24  92,72 0 top
D1  100.25,105.25 270 top
D5  69.25,32.65 180 top
D6  100.25,34.25 90 top
D7  38.25,105.25 270 top
D8  38.25,33.25 90 top
IMU  69.25,69.25 0 top
J1  70.25,89.15 0 top
J2  84.25,62.25 0 top
J3  58.25,106.25 0 top
JP1  106.25,54.25 90 top
JP9  106.25,71.25 90 top
LED2  71.55,81.35 180 top
LED3  71.55,79.05 180 top
NET_BRIDGE  87.15,68.6 270 top
Q1  106.25,100.25 0 top
Q2  106.25,38.25 180 top
Q3  32.25,99.25 0 top
Q4  32.25,38.25 180 top
R1  71.95,84.45 0 top
R2  102.95,97.25 90 top
R3  106.05,96.25 180 top
R4  103.05,42.95 90 top
R5  67.25,79.05 180 top
R6  67.25,81.35 180 top
R7  106.25,42.05 0 top
R8  35.45,96.05 90 top
R9  32.25,95.05 180 top
R10  35.55,42.55 270 top
R11  32.25,41.95 0 top
R12  62.9,70.75 0 top
R13  62.9,68.2 0 top
SW2  48.65,63.05 180 top
U1  56.75,83.45 0 top
U$1  104.25,105.25 0 top
U$2  104.25,33.25 0 top
U$3  34.25,105.25 180 top
U$4  34.25,33.25 180 top
V_REG  92,67.75 0 top
Y1  58.75,92.5 0 top

### Tracks (layer width: path | path; a pad name or v marks a point on that pad's centre or on a via)
BAT_GND  (via drill 0.38, 0.6)
  Top 0.457: 101.35,38 97.5,38 96.25,39.25 C12.2 96.25,39 93.75,36.5 92.25,36.5 v92.05,36.35 | 101.35,38 103.75,38 105.25,39.5 Q2.2 | BATT1.- 84,67.25 85.75,69 87,69 NET_BRIDGE.P$1 87.25,69 88.5,70.25 v101.25,70.25 | D5.P$2 67.75,32.75 64,32.75 v63.95,32.65 | v46.95,36.25 44.25,36.25 42.25,38.25 C17.2 42.07,38.49 41.38,39.17 37.19,39.17 C16.2 37.12,39.48 37.12,41.61 36.28,42.45 34.98,42.45 34.37,43.06 32.7,43.06 31.55,41.92 R11.1 31.33,41.92 31.33,39.56 Q4.2 | v92.35,101.75 94.75,101.75 96.25,100.25 C8.2 96.4,100.29 101.28,100.29 C7.1 101.51,100.06 101.51,96.17 102.57,95.11 105.54,95.11 106.54,96.1 106.84,96.1 R3.1 107.07,96.25 107.07,98.84 107.14,98.92 Q1.2 | v46.15,101.95 46,101.75 43.75,101.75 42.25,100.25 C14.2 42.3,99.91 40.9,96.11 | R7.1 105.24,42.07 104.55,42.07 103.79,42.83 102.27,42.83 101.35,41.92 C10.1 101.35,39.02 101.35,38 | 40.9,96.11 36.28,93.89 34.6,93.89 33.46,95.03 33.23,95.03 R9.1 | 36.74,99.07 36.74,99.52 35.9,100.36 34.75,100.36 34.37,99.98 34.37,99.14 33.23,98 Q3.2 | 40.9,96.11 36.74,99.07 | C13.1 36.75,99.25 36.74,99.07 | C23.1 93.75,63.75 101.75,63.75 v102.05,63.45
  pour Route15: 30.95,106.35 30.95,101.15 101.25,101.05 101.25,37.15 31.25,37.15 31.25,32.05 106.25,32.05 106.25,106.35
FILTERED1
  Top 0.457: R2.1 102.95,96.25 R3.2 105.16,96.48 105.16,98.84 Q1.1 105.24,98.99 104.02,100.21 103.18,100.21 C7.2
FILTERED2
  Top 0.457: 103.11,40.77 103.11,39.25 C10.2 | 103.11,40.77 103.11,41.92 R4.1 | 107.22,40.77 107.22,39.56 Q2.1 | 107.22,40.77 107.22,41.99 R7.2 | 107.22,40.77 103.11,40.77
FILTERED3
  Top 0.457: 31.33,96.48 31.33,97.92 Q3.1 | 31.33,96.48 31.33,95.11 R9.2 | 33.84,96.48 35.21,95.11 35.44,95.11 R8.1 | 31.33,96.48 33.84,96.48 | C13.2 35.29,99.22 35.29,98.46 34.15,97.31 34.15,96.78 33.84,96.48
FILTERED4
  Top 0.457: R10.2 35.52,41.61 33.38,41.61 R11.2 33.23,41.92 33.23,39.56 Q4.1 33.46,39.48 33.69,39.25 35.29,39.25 C16.1
FLYBACK1
  Top 0.457: 103.75,103.75 104.75,103.75 U$1.V- | 103.75,103.75 100.25,103.75 D1.A | 103.75,103.75 106.25,101.25 Q1.3
FLYBACK2
  Top 0.457: 106.25,37.25 101.5,37.25 100.25,36 D6.A | 106.25,37.25 U$2.V- | 106.25,37.25 Q2.3
FLYBACK3
  Top 0.457: D7.A 38.25,103.75 33.75,103.75 U$3.V- Q3.3
FLYBACK4
  Top 0.457: 32.25,37.25 36,37.25 38.25,35 D8.A | 32.25,37.25 U$4.V- | 32.25,37.25 Q4.3
GND  (via drill 0.38)
  Top 0.152: 61.75,75.75 60,75.75 C3.1 | 61.75,75.75 62,75.75 64,73.75 C22.2 | 61.75,75.75 61.75,79.75 U1.33 61.5,79.75 60.5,79.75 60.5,80.25 | 60.5,80.25 60.5,80.5 60.75,80.75 61.5,80.75 U1.35 | 50.25,84.25 49.25,84.25 49.16,84.25 | 50.25,84.25 51.75,84.25 U1.7 52,84.06 52.74,84.06 52.87,83.93 52.87,82.96 52.74,82.83 52,82.83 U1.10 52,82.75 52,82.25 | 54.5,82.25 54.5,81.25 | 54.5,81.25 54.5,79.75 | 54.5,79.75 U1.20 | 52,82.25 54.5,82.25 | 52,82.25 U1.11 51.75,82.25 49.25,82.25 49.14,82.25 | U1.24 56.5,79.5 56.25,79.75 54.5,79.75 | 54.5,82.25 54.5,85.75 | 54.5,85.75 54.5,87.25 | 54.5,87.25 U1.61 | U1.58 56,87.25 54.5,87.25 | U1.55 57.5,87.5 58,87 58,85.75 54.5,85.75 | 60.5,80.25 59.75,80.25 58.75,81.25 54.5,81.25 | C20.2 73.75,68 73.75,69.75 C19.2 73.5,70 71.25,70 | 71.25,69 71.25,68.5 IMU.14 | 71.25,70 71.25,69.5 | 71.25,69.5 71.25,69 | 71.25,69 IMU.15 | 71.25,69.5 IMU.16 | 70.25,71 70,71 IMU.20 | 70.25,71 70.75,71 | 70.25,71 IMU.19 | 70.75,71 70.75,73.25 C18.1 70.75,73.5 71.75,74.5 | 71.25,70 71.25,71 70.75,71 | 70.75,71 IMU.18 | 71.25,70 IMU.17 | LED2.C 72.75,81.25 72.75,79.25 LED3.C 72.5,79 71.75,79 68.75,76 | 68.75,76 68,75.25 C21.1 | 71.75,74.5 71.75,76 68.75,76 | 53,76.25 54,76.25 C4.1 | 53,76.25 52.25,76.25 C2.2 | v88.25,68.25 87.25,68.25 NET_BRIDGE.P$2 | v66,67.5 67.75,67.5 IMU.6 | 104,69.25 106.25,67 JP1.GND | 104,69.25 102,71.25 93.75,71.25 93,72 C24.2 92.75,72 91.75,73 73.25,73 71.75,74.5 | v63.25,85.75 61.75,85.75 U1.45 | 46.25,62.75 46.25,58.5 SW2.3 | 46.25,62.75 43.25,62.75 v43.15,62.85 | 46.25,62.75 46.25,67.5 SW2.4 | v53,73 53,76.25 | 104,69.25 93,69.25 V_REG.4 92.75,68.75 92.25,68.25 92.25,66.75 V_REG.2 | 42.37,78.8 C9.2
  Top 0.152: 43.75,78.92 43.75,78.75 C11.1 | 57.5,97 55.25,97 52.25,94 v52.25,92.75 52.25,91.5 52,91.25 C1.2 | 57.5,97 57.5,96 C5.2 | 57.5,97 60.5,97 61.5,96 C6.2 | v50,92.75 50.25,92.5 50.25,84.25
  Route2 0.152: v50,92.75 v52.25,92.75
  Route15 0.152: v66,67.5 65.84,67.5
  Bottom 0.152: 106.25,68.25 v88.25,68.25 | JP1.GND 106.25,68.25 | J3.10 81,106.25 73,98.25 73,90.5 J1.6 | 106.25,68.25 107.5,69.5 107.5,82.5 106.25,83.75 JP9.GND
  pour Route15: 31.35,99.85 31.25,90.25 49.75,90.05 49.65,71.15 31.25,71.25 31.35,38.25 99.85,38.25 99.85,99.85
  pour Top: 39.1,88.25 39,76.45 49.1,76.55 49.2,88.25
  pour Route2: 39,88.25 38.75,76.35 48.9,76.45 49.15,88.35
MISO  (via drill 0.38)
  Top 0.152: v60,82.75 61.5,82.75 U1.39
  Route15 0.152: v60,82.75 61.5,82.75 66.75,88 67.5,88 J1.1
MOSI  (via drill 0.38)
  Top 0.152: v60,81.25 60,81.5 60.75,82.25 61.5,82.25 U1.38
  Route2 0.152: v60,81.25 66.5,87.75 66.5,88.5 67.25,89.25 69.25,89.25 70.25,90.25 J1.4
N$1
  Top 0.152: 56.5,91.75 Y1.1 56.75,91.5 | 56.5,91.75 55.5,92.75 55.5,95.5 55.75,95.75 C5.1 | 56.5,91.75 U1.57
N$2
  Top 0.152: C2.1 52,74.5 51,75.5 51,77.5 54.75,77.5 55,77.75 U1.21 55,78.75 55.5,78.75 U1.22
N$3
  Top 0.152: U1.9 44,83.2 B1.3
N$4
  Top 0.152: U1.60 55,89.25 54.75,89.5 53.75,89.5 53.75,91.25 C1.1
N$5
  Top 0.152: U1.8 43.8,83.7 B1.4
N$6
  Top 0.152: 60.5,93.75 60.5,95.25 60,95.75 C6.1 | U1.56 57,89.5 58.25,90.75 58.25,91.5 60.5,93.75 | 60.5,93.75 Y1.3
N$7
  Top 0.152: 42.7,82.3 B1.2 42.8,82.55 C11.2
N$8
  Top 0.406: 41.17,82.99 41.15,82.19 41.15,81.74 C9.1
  Top 0.457: A1.FEED 41.17,82.99 B1.1
N$9  (via drill 0.38)
  Top 0.152: U1.27 58,77.75 58.75,77 58.75,75 60.5,75 v61.5,74
  Bottom 0.152: v61.5,74 64.25,71.25 64.25,67.5 73.25,58.5 106.25,58.5 JP1.TXO
N$10
  Top 0.152: LED3.A 70.5,79.25 68.25,79.25 R5.1
N$11
  Top 0.152: LED2.A 70.5,81.5 68.25,81.5 R6.1
N$12  (via drill 0.38)
  Top 0.152: v58.5,80.25 U1.28
  Bottom 0.152: v58.5,80.25 56,77.75 56,72.25 71.25,57 106.25,57 JP1.RXI
N$13
  Top 0.152: IMU.21 69.5,71 69.5,75 70.5,75 C18.2
N$14
  Top 0.152: JP9.DTR 102.75,71.25 100.75,73.25 C15.2
N$15
  Top 0.152: IMU.24 68.25,71 68.25,73.25 68,73.25 C21.2
N$18
  Bottom 0.457: J2.1 84.25,64.25 84,64.5 BATT1.+
N$20
  cutout Route2: 32.25,89.75 32.25,71.75 48.65,71.85 48.75,76.45 38.35,76.35 38.65,89.75
N$21
  cutout Route15: 32.25,89.75 32.25,71.75 48.65,71.85 48.85,76.55 38.45,76.45 38.65,89.75
N$22
  cutout Route2: 66.25,72.25 72.25,72.25 72.25,66.25 66.25,66.25
  cutout Route15: 66.25,72.25 72.25,72.25 72.25,66.25 66.25,66.25
N$23  (via drill 0.6)
  other vias: 40.45,87.05
N$24  (via drill 0.6)
  other vias: 42.55,87.05
N$25  (via drill 0.6)
  other vias: 44.75,87.05
N$26  (via drill 0.6)
  other vias: 46.85,87.05
N$27  (via drill 0.6)
  other vias: 47.85,85.55
N$28  (via drill 0.6)
  other vias: 47.85,82.15
N$29  (via drill 0.6)
  other vias: 47.85,80.15
N$30  (via drill 0.6)
  other vias: 47.75,78.05
N$31  (via drill 0.6)
  other vias: 40.15,77.35
N$32  (via drill 0.6)
  other vias: 42.75,77.25
N$33  (via drill 0.6)
  other vias: 45.15,77.35
PB6
  Top 0.152: R5.2 66.25,79.25 64.25,81.25 64.25,83.75 63,83.75 62.5,84.25 61.75,84.25 U1.42
PB7
  Top 0.152: R6.2 66.25,81.5 66.25,84.25 63,84.25 62.5,84.75 61.75,84.75 U1.43
PWM1
  Top 0.152: R2.2 102.88,98.23 102.88,99.07 102.19,99.75 102.19,100.9 100.36,102.73 74.45,102.73 70.95,106.23 J3.6 70.87,106.23 70.42,106.23 66.23,102.04 66.23,95.11 61.65,90.53 60.89,90.53 59.52,89.16 59.52,88.4 U1.51
PWM2  (via drill 0.38)
  Top 0.152: 66.53,89.24 62.42,89.24 62.26,89.39 60.28,89.39 60.05,89.16 60.05,88.4 U1.50 | 66.53,89.24 91.45,89.24 105.54,75.14 106.61,75.14 107.45,74.3 107.45,53.73 103.11,49.39 103.11,43.97 R4.2 | v68.36,103.03 68.36,101.58 66.53,99.75 66.53,89.24
  Bottom 0.152: v68.36,103.03 68.36,106.23 J3.5
PWM3  (via drill 0.38, 0.6)
  Top 0.152: v62,88.5 60.5,88.5 U1.49 | v60.05,98.15 v52.95,98.15 | v37.55,96.65 R8.2
  Bottom 0.152: v62,88.5 65.75,92.25 65.75,98.15 | 65.75,98.15 65.75,106.25 J3.4 | v60.05,98.15 65.75,98.15 | v52.95,98.15 45.85,98.15 45.85,95.45 37.65,96.65 v37.55,96.65
PWM4  (via drill 0.38)
  Top 0.152: v35.59,44.74 35.59,43.52 R10.1 | v56.17,82.07 58.15,82.07 59.75,83.68 61.58,83.68 U1.41
  Bottom 0.152: v35.59,44.74 35.59,54.11 55.63,74.15 55.63,81.54 v56.17,82.07 56.17,107.14 56.85,107.83 60.74,107.83 62.26,106.31 63.25,106.31 J3.3
RESET  (via drill 0.38)
  Top 0.152: U1.12 51.75,81.75 51,81.75 50.5,81.25 50.5,67.75 50.75,67.75 SW2.2 51,67.5 51,65.5 | 51,65.5 51,58.5 SW2.1 | 73.5,83.75 81.75,75.5 96.5,75.5 98.75,73.25 C15.1 | 73.5,83.75 73,84.25 R1.2 | 73.5,83.75 v74.25,84.5 | v67.5,65.5 51,65.5
  Bottom 0.152: J1.5 73,87.75 74.25,86.5 v74.25,84.5 74.25,65.5 v67.5,65.5
RX0  (via drill 0.38)
  Top 0.152: v66,86 65.25,86.75 63,86.75 62.5,86.25 61.75,86.25 U1.46
  Bottom 0.152: v66,86 71.5,86 71.5,88.25 72.5,89.25 105,89.25 105,77.75 106.25,76.5 JP9.TXO
SCK  (via drill 0.38)
  Top 0.152: v63.25,81.75 61.75,81.75 U1.37
  Bottom 0.152: v63.25,81.75 65,83.5 65,87.5 66.75,89.25 70.25,89.25 J1.3
SCL  (via drill 0.38)
  Top 0.152: 65.25,70 64,70 64,70.75 R12.2 | 65.25,70 67.25,70 IMU.2 | v57,77 U1.25 | v65.25,70.5 65.25,70
  Bottom 0.152: J3.1 58.25,81.75 59.5,80.5 59.5,79.5 v57,77 65.25,77 v65.25,70.5
SDA  (via drill 0.38)
  Top 0.152: IMU.4 67.25,69 64.75,69 64,68.25 R13.2 63.75,68.25 62.5,69.5 v61,69.5 | U1.26 57.5,79.75 v57,80.25
  Route2 0.152: v61,69.5 61,73.25 58,76.25 58,79.25 v57,80.25
  Bottom 0.152: v57,80.25 57,107.5 59.5,107.5 60.75,106.25 J3.2
TX0
  Top 0.152: U1.47 61.75,86.75 62.5,86.75 63,87.25 66,87.25 67.75,85.5 94.75,85.5 106.25,74 JP9.RXI
VBAT  (via drill 0.6)
  Top 0.457: 91.25,65.25 91.25,64.75 92.5,63.5 C23.2 92.25,63.5 92.25,62.25 90.75,62.25 | 91.25,65.25 91.25,66.25 V_REG.1 | 91.25,65.25 92.75,65.25 92.75,66.25 V_REG.3 | J2.2 90.75,62.25 | U$1.V+ 101.75,105.25 100.25,106.75 D1.C 100.25,106.5 96.25,106.5 C8.1 96.25,106.25 96,106 92.25,106 v92.25,105.95 | U$4.V+ 36.75,33.25 38.25,31.75 D8.C 38.25,32 42.25,32 C17.1 42.25,32.25 47,32.25 v47.05,32.15 | U$2.V+ 100.75,33.25 100.25,32.75 D6.C 100.25,33 96.25,33 | U$3.V+ 36.75,105.25 38.25,106.75 D7.C 38.25,106.5 42.25,106.5 C14.1 42.25,106.25 42.5,106 46,106 v46.05,105.85 | D5.P$1 70.75,32.75 74.75,32.75 v74.75,32.65 | 96.25,33 95.75,32.5 92.25,32.5 v92.05,32.45 92,32.5 90.75,32.5 90.75,62.25 | 96.25,33 C12.1
  pour Route2: 30.95,107.85 31.05,101.35 101.25,101.25 101.25,37.25 30.85,37.25 30.75,30.75 107.75,31.35 107.35,106.35
VCC
  Top 0.152: U1.59 55.5,91 54.25,92.25 53,92.25 52.75,92 52.75,90.25 51.25,90.25 51,90.5 51,104.25 62.5,104.25 | 62.5,104.25 68,104.25 69.75,106 69.75,107.5 72,107.5 73.25,106.25 J3.7 | 64.5,67.5 64.25,67.25 62.75,67.25 62,68 R13.1 61.75,68.25 61.5,68.5 60.75,68.5 60,69.25 60,70.75 | 64.5,67.5 65.5,68.5 67.25,68.5 IMU.5 | 68.5,67.5 68.25,67.5 IMU.7 | V_REG.5 88,66 80.5,66 | 79.25,66 73.75,66 C20.1 73.5,66.25 72,66.25 71.75,66.5 | 79.25,66 80.5,66 | 71.75,66.5 70.75,67.5 IMU.13 | 79.25,66 73.75,71.5 C19.1 | 80.5,66 85.25,70.75 89.75,70.75 91,72 C24.1 | 68.5,66.5 68.5,67.5 | 71.75,66.5 68.5,66.5 | 68.5,67.5 IMU.8 | 64.5,67.5 65.5,66.5 68.5,66.5 | 67,84.75 63,84.75 62.5,85.25 61.75,85.25 U1.44 61.5,85.25 60.25,85.25 58,87.5 U1.54 58,89.25 58.25,89.5 58.75,89.5 58.75,91.5 59.5,92.25 62.5,92.25 62.5,104.25 | 67,84.75 70.5,84.75 70.75,84.5 R1.1 | 66,72.75 67.75,71 IMU.1 | 66,72.75 66,73.5 C22.1 66,73.75 66.5,74.25 | 66.5,74.25 69,74.25 69,71 IMU.22 IMU.23 | 64.75,78 66.5,76.25 66.5,74.25 | 64.75,78 62.5,80.25 61.75,80.25 U1.34 | IMU.3 67.25,69.5 63.25,69.5 62,70.75 R12.1 60,70.75 | 60,70.75 60,72.5 | 60,72.5 60,73.25 | 60,73.25 60,74 C3.2 | 60,73.25 56,73.25 | 56,73.25 55.25,73.25 54.25,74.25 C4.2 | 56,73.25 U1.23 | 66,72.75 65.75,72.5 60,72.5 | 67,84.75 67,78 64.75,78
  pour Route2 (rank 2): 32.25,99.75 32.25,90.75 49.65,90.85 49.65,70.25 31.45,70.35 31.45,38.25 99.75,38.25 99.75,99.75

### Text on the board
tPlace: SCL | SDA | VCC | GND | PWM4 | PWM3 | PWM2 | PWM1 | VBAT | BAT_GND | GND | TX0 | RXI | DTR | (res) | GND | TX0 | RXI